# Altium project Simon_game.PrjPcb
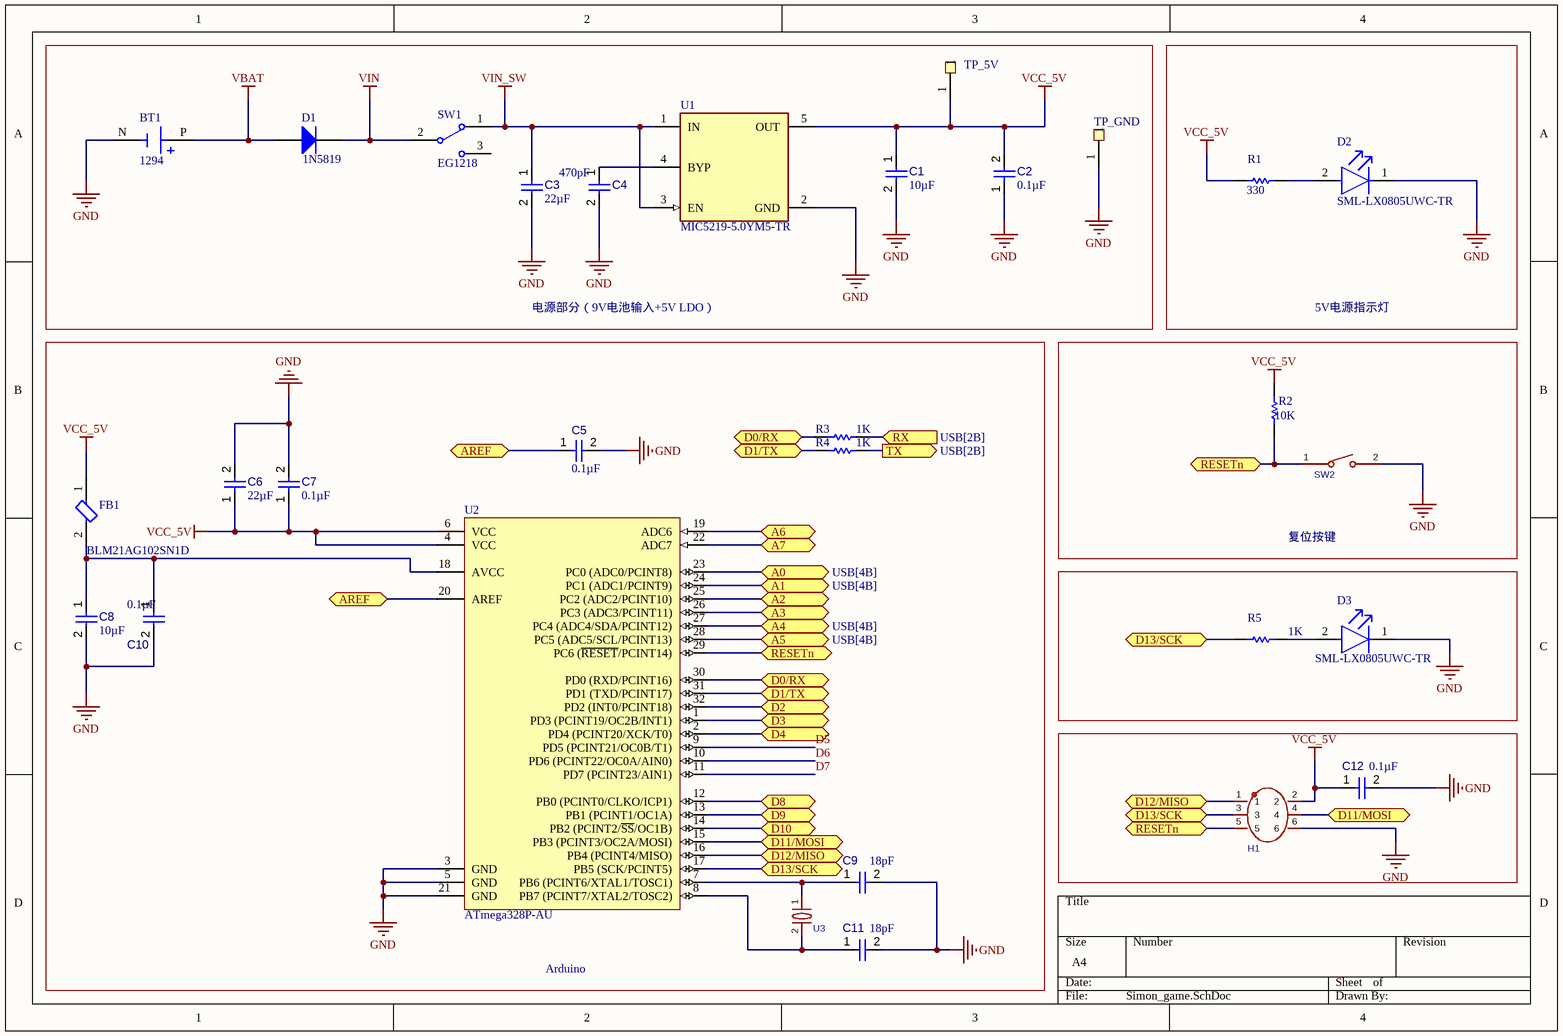
[diagram p0: Simon_game.SchDoc]
3 sheets, 87 parts. Net scope: global (net labels, ports and power ports of the same name join across sheets).
Board file: Simon_game.PcbDoc
Sheets:
  Simon_game.SchDoc
  USB.SchDoc
  buttons_audio_amplifier.SchDoc

## Sheet Simon_game.SchDoc
size A4; SheetNumber: 1; SheetTotal: 3

### Parts
BT1  1294  [BAT_1294]
C1  value 10µF  [CAPC2013X135X45NL10T25]  (hidden comment: Capacitor 10 uF +/- 10% 16 V 0805)
C2  value 0.1µF  [CAPC2013X135X45NL10T25]  (hidden comment: Capacitor 10 uF +/- 10% 16 V 0805)
C3  value 22µF  [CAPC2013X135X45NL10T25]  (hidden comment: Capacitor 10 uF +/- 10% 16 V 0805)
C4  value 470pF  [CAPC2013X135X45NL10T25]  (hidden comment: Capacitor 10 uF +/- 10% 16 V 0805)
C5  value 0.1µF  [CAPC2013X135X45NL10T25]  (hidden comment: Capacitor 10 uF +/- 10% 16 V 0805)
C6  value 22µF  [CAPC2013X135X45NL10T25]  (hidden comment: Capacitor 10 uF +/- 10% 16 V 0805)
C7  value 0.1µF  [CAPC2013X135X45NL10T25]  (hidden comment: Capacitor 10 uF +/- 10% 16 V 0805)
C8  value 10µF  [CAPC2013X135X45NL10T25]  (hidden comment: Capacitor 10 uF +/- 10% 16 V 0805)
C9  value 18pF  [CAPC2013X135X45NL10T25]  (hidden comment: Capacitor 10 uF +/- 10% 16 V 0805)
C10  value 0.1µF  [CAPC2013X135X45NL10T25]  (hidden comment: Capacitor 10 uF +/- 10% 16 V 0805)
C11  value 18pF  [CAPC2013X135X45NL10T25]  (hidden comment: Capacitor 10 uF +/- 10% 16 V 0805)
C12  value 0.1µF  [CAPC2013X135X45NL10T25]  (hidden comment: Capacitor 10 uF +/- 10% 16 V 0805)
D1  1N5819  [ONSC-AXIAL_LEAD-2-59-10_P]
D2  SML-LX0805UWC-TR  [FP-SML-LX0805UWC-TR-MFG]
D3  SML-LX0805UWC-TR  [FP-SML-LX0805UWC-TR-MFG]
FB1  BLM21AG102SN1D  [FP-BLM21-0_2-t0_85-e0_5-MFG]
H1  PM2.54-2*3  [HDR-TH_6P-P2.54-V-F-R2-C3-S2.54]  (value not drawn)
R1  value 330  [RESC2013X50X35ML15T15]  (hidden comment: Resistor 0R +/- 1% 0805 125 mW)
R2  value 10K  [RESC2013X50X35ML15T15]  (hidden comment: Resistor 0R +/- 1% 0805 125 mW)
R3  value 1K  [RESC2013X50X35ML15T15]  (hidden comment: Resistor 0R +/- 1% 0805 125 mW)
R4  value 1K  [RESC2013X50X35ML15T15]  (hidden comment: Resistor 0R +/- 1% 0805 125 mW)
R5  value 1K  [RESC2013X50X35ML15T15]  (hidden comment: Resistor 0R +/- 1% 0805 125 mW)
SW1  EG1218  [ESWI-EG1218_V]
SW2  TS-1088-AR02016  [SW-SMD_L3.9-W3.0-P4.45]  (value not drawn)
TP_5V  TP_5V  [PCBComponent_1]  (value not drawn)
TP_GND  Component_1  [PCBComponent_1]  (value not drawn)
U1  MIC5219-5.0YM5-TR  [FP-SOT23-5LD-PL-1-MFG]
U2  ATmega328P-AU  [32A_M]
U3  ABLS-12.000MHZ-B4H-T  [CRYSTAL-SMD_L11.4-W4.7-LS12.7]  (value not drawn)

### Blocks framed on the sheet
电源部分（9V电池输入+5V LDO）: BT1 C1-C4 D1 SW1 TP_5V TP_GND U1
5V电源指示灯: D2 R1
Arduino: C5-C11 FB1 R3 R4 U2 U3
复位按键: R2 SW2

### Ports
A0 (bidir, see USB[4B]), A1 (bidir, see USB[4B]), A2 (bidir, see buttons_audio_amplifier[3A], USB[4B]), A3 (bidir, see buttons_audio_amplifier[3A], USB[4B]), A4 (bidir, see USB[4B]), A5 (bidir, see USB[4B]), A6 (bidir, see buttons_audio_amplifier[3B], USB[4B]), A7 (bidir, see buttons_audio_amplifier[3B], USB[4B]), AREF (bidir, see Simon_game[1C], USB[4B]), AREF (bidir, see Simon_game[2B], USB[4B]), D0/RX (bidir, see Simon_game[2B], USB[4C]), D0/RX (bidir, see Simon_game[2C], USB[4C]), D1/TX (bidir, see Simon_game[2B], USB[4C]), D1/TX (bidir, see Simon_game[2C], USB[4C]), D2 (bidir, see USB[4C]), D3 (bidir, see USB[4C]), D4 (bidir, see USB[4C]), D8 (bidir, see buttons_audio_amplifier[4C], USB[4C]), D9 (bidir, see buttons_audio_amplifier[1C], USB[4C]), D10 (bidir, see USB[4C]), D11/MOSI (bidir, see Simon_game[2D], USB[4C]), D11/MOSI (bidir, see Simon_game[4D], USB[4C]), D12/MISO (bidir, see Simon_game[2D], USB[4C]), D12/MISO (bidir, see Simon_game[3D], USB[4C]), D13/SCK (bidir, see Simon_game[2D], Simon_game[3C], USB[4B]), D13/SCK (bidir, see Simon_game[2D], Simon_game[3D], USB[4B]), D13/SCK (bidir, see Simon_game[3C], Simon_game[3D], USB[4B]), RESETn (bidir, see Simon_game[2C], Simon_game[3D], USB[2B], USB[4B], USB[4C]), RESETn (bidir, see Simon_game[2C], Simon_game[4B], USB[2B], USB[4B], USB[4C]), RESETn (bidir, see Simon_game[3D], Simon_game[4B], USB[2B], USB[4B], USB[4C]), RX (in, see USB[2B]), TX (out, see USB[2B])

### Nets
GND: BT1.N(NEG) C1.2 C2.1 C3.2 C4.2 C5.2 C6.2 C7.2 C8.2 C9.2 C10.2 C11.2 C12.2 D2.1(C) D3.1(C) H1.6 SW2.2 TP_GND.1 U1.2(GND) U2.3(GND) U2.5(GND) U2.21(GND)
VBAT: BT1.P(POS) D1.1(A)
VCC_5V: C1.1 C2.2 C6.1 C7.1 C12.1 FB1.1 H1.2 R1.1 R2.2 TP_5V.1 U1.5(OUT) U2.4(VCC) U2.6(VCC)
VIN: D1.2(K) SW1.2(COM)
VIN_SW: C3.1 SW1.1 U1.1(IN) U1.3(EN)
D5: U2.9(PD5_(PCINT21/OC0B/T1))
D6: U2.10(PD6_(PCINT22/OC0A/AIN0))
D7: U2.11(PD7_(PCINT23/AIN1))
NetC4_1: C4.1 U1.4(BYP)
NetC5_1: C5.1 U2.20(AREF) ; port AREF
NetC8_1: C8.1 C10.1 FB1.2 U2.18(AVCC)
NetC9_1: C9.1 U2.7(PB6_(PCINT6/XTAL1/TOSC1)) U3.1
NetC11_1: C11.1 U2.8(PB7_(PCINT7/XTAL2/TOSC2)) U3.2(GND)
NetC17_2: H1.5 R2.1 SW2.1 U2.29(PC6_(~{RESET}/PCINT14)) ; port RESETn
NetD2_2: D2.2(A) R1.2
NetD3_2: D3.2(A) R5.2
NetH1_1: H1.1 U2.16(PB4_(PCINT4/MISO)) ; port D12/MISO
NetH1_3: H1.3 R5.1 U2.17(PB5_(SCK/PCINT5)) ; port D13/SCK
NetH1_4: H1.4 U2.15(PB3_(PCINT3/OC2A/MOSI)) ; port D11/MOSI
NetJ1_1: R4.1 U2.31(PD1_(TXD/PCINT17)) ; port D1/TX
NetJ1_2: R3.1 U2.30(PD0_(RXD/PCINT16)) ; port D0/RX
NetJ1_5: U2.32(PD2_(INT0/PCINT18)) ; port D2
NetJ1_6: U2.1(PD3_(PCINT19/OC2B/INT1)) ; port D3
NetJ1_7: U2.2(PD4_(PCINT20/XCK/T0)) ; port D4
NetJ1_11: U2.12(PB0_(PCINT0/CLKO/ICP1)) ; port D8
NetJ1_12: U2.13(PB1_(PCINT1/OC1A)) ; port D9
NetJ1_13: U2.14(PB2_(PCINT2/~{SS}/OC1B)) ; port D10
NetJ2_5: U2.22(ADC7) ; port A7
NetJ2_6: U2.19(ADC6) ; port A6
NetJ2_7: U2.28(PC5_(ADC5/SCL/PCINT13)) ; port A5
NetJ2_8: U2.27(PC4_(ADC4/SDA/PCINT12)) ; port A4
NetJ2_9: U2.26(PC3_(ADC3/PCINT11)) ; port A3
NetJ2_10: U2.25(PC2_(ADC2/PCINT10)) ; port A2
NetJ2_11: U2.24(PC1_(ADC1/PCINT9)) ; port A1
NetJ2_12: U2.23(PC0_(ADC0/PCINT8)) ; port A0
NetR3_2: R3.2 ; port RX
NetR4_2: R4.2 ; port TX

Not connected (* = marked no-connect by the designer): SW1 3

### Library data of the parts
BT1 = 1294: 9 Volt Battery Holder- PC Terminals; MF: Keystone Electronics; SnapEDA_Link: https://www.snapeda.com/parts/1294/Keystone/view-part/?ref=snap; Package: NON STANDARD-6 Keystone; Value: *; MP: 1294; Check_prices: https://www.snapeda.com/parts/1294/Keystone/view-part/?ref=eda
C1-C12 = CMP-001-00015-6: Chip Capacitor, 10 uF, +/- 10%, 16 V, 0805 (2012 Metric); Voltage Rating: 16V; Capacitor Type: Ceramic; RoHS Compliant: True; Max Operating Temperature: 85°C; Min Operating Temperature: -55°C; Mounting Technology: SM; Tolerance: 10%; Case/Package: 0805; Pins: 2
D1 = CMP-004-00009-2: Low Drop Power Schottky Rectifier, 40 V, 1 A, 2-Pin DO-41, RoHS; Manufacturer: ON Semiconductor; Max Surge Current: 25A; Forward Current: 1A; Package Version: Rev. U, 02/2005; Peak Reverse Current: 1mA; Max Operating Temperature: 125°C; Case/Package: DO; Package URL: http://www.onsemi.cn/pub_link/Collateral/59-10.PDF; Packaging: Bulk; Manufacturer URL: http://www.onsemi.com/; Min Operating Temperature: -65°C; Package Description: 2-Pin, Axial Lead, Diameter 2.35 mm; Mounting Technology: TH; Datasheet URL: http://www.onsemi.cn/pub_link/Collateral/1N5817-D.PDF; Datasheet Version: Rev. 10, 07/2006; Package Reference: AXIAL_LEAD-2-59-10; Pins: 2; RoHS Compliant: True
D2 D3 = CMP-00229-00139794-1: SML-LX0805UWC-TR White LED, 0805 Diffused, Rectangle Lens SMD package; NexarPartId: 139794; Approvals: CSA, UL; Lens Color: Clear, Yellow; Luminous Intensity: 150mcd; Power Rating: 120mW; Forward Current: 20mA; Forward Voltage: 3.5V; Number of LEDs: 1; Viewing Angle: 120°; RoHS: Compliant; Case/Package: 0805; Illumination Color: White; Min Operating Temperature: -40°C; Mount: Surface Mount; Max Operating Temperature: 85°C
FB1 = CMP-0686-00665-3: Chip Ferrite Bead, 0805, 1000Ω @ 100MHz, 0.27Ω, 25%, 600mA; Material: Steel; Number of Lines: 1; Current Rating: 500mA; Max DC Current: 200mA; Impedance: 1kR; DC Resistance (DCR): 280mR; Shielding: Unshielded; Length: 2mm; Max Current Rating: 600mA; Max Operating Temperature: 125°C; Lead Free: Lead Free; Test Frequency: 100MHz; Number of Pins: 2; Height: 0.85mm; Package Quantity: 1; Termination: SMD/SMT; Depth: 1.25mm; Radiation Hardening: No; Case Code (Metric): 2012; Tolerance: 25%; Core Material: Ferrite; Min Operating Temperature: -55°C; Case Code (Imperial): 0805; Weight: 0.000194oz; DC Current: 200mA; Case/Package: 0805; REACH SVHC: No SVHC; Frequency: 100MHz; Military Standard: Not; Number of Circuits: 1; Width: 1.25mm; Packaging: Tape and Reel
R1-R5 = CMP-009-00001-5: Chip Resistor, 0 Ohm, +/- 1%, 125 mW, -55 to 155 degC, 0805 (2012 Metric); Voltage Rating: 150V; Power: 125mW; Mounting Technology: SM; Max Operating Temperature: 155°C; Case/Package: 0805; RoHS Compliant: True; Pins: 2; Min Operating Temperature: -55°C; Tolerance: 1%
SW1 = CMP-1696-00002-1: Slide Switch, 500 V, -20 to 70 degC, 3-Pin THD, RoHS; Case\Package: SOT-23-5; Output Current: 150 mA; Nominal Output Voltage: 3.3 V; Max Power Dissipation: 250 mW; Min Input Voltage: 4.3 V; Outputs: 1; Max Input Voltage: 8 V; Dropout Voltage: 300 mV; PackageDescription: 3-Pin Through Hole Device, Body 11.6 x 4 mm, Pitch 2.5 mm; ComponentLink1URL: http://www.e-switch.ch/en/; RoHSCompliant: true; Length: 3 mm; ComponentLink1Description: Manufacturer URL; Power Rating: 250 mW; Mount: Surface Mount; Max Operating Temperature: 85 degC; REACH SVHC: No SVHC; Radiation Hardening: No; Height: 1.3 mm; Pins: 5; Max Ouput Current: 150 mA; Output Voltage: 3.3 V; Width: 1.8 mm; Package Quantity: 3000; ComponentLink2URL: https://www.e-switch.com/system/asset/product_line/data_sheet/119/EG.pdf; Min Operating Temperature: -40 degC; ComponentLink2Description: Datasheet; DatasheetVersion: Oct-15; PackageReference: EG1218; Packaging: Tape and Reel
TP_5V = Component_1
U1 = CMP-06324-000019-1: IC REG LINEAR 5V 500MA SOT23-5; Manufacturer: Microchip Technology; Number Of Outputs: 1; Accuracy Percentage: 1%; Min Supply Voltage: 2.5V; Dropout Voltage: 350mV; Nominal Supply Current: 80-12000uA; Standoff Height: 0mm; Max Junction Temp: +125°C; Output Type: Fixed; Max Supply Voltage: 12V; ComponentLink2Description: Datasheet; Manufacturer Part Number: MIC5219-5.0YM5-TR; Category: IC; Height: 1.45mm; Temperature: -40°C to +125°C; Device Class L1: Integrated Circuits (ICs); Device Class L3: Voltage Regulators - Linear; Octopart: https://octopart.com/mic5219-5.0ym5-tr-microchip-66802269; Output Current: 500mA; Temperature Range Low: -40°C; Lead Free: Yes; Package: SOT23-5LD-PL-1; Automotive: No; Ambient Temperature Range High: +125°C; ComponentLink2URL: http://ww1.microchip.com/downloads/en/DeviceDoc/MIC5219-500mA-Peak-Output-LDO-Regulator-DS20006021A.pdf; Output Voltage: 5V; Temperature Range High: +125°C; Digikey Description: IC REG LINEAR 5V 500MA SOT23-5; Ambient Temperature Range Low: -40°C; RoHS: TRUE; Mouser Description: IC REG LINEAR 5V 500MA SOT23-5; Device Class L2: Power Management ICs
U2 = CMP-0095-00269-2: 8-bit AVR Microcontroller, 32KB Flash, 1KB EEPROM, 2KB SRAM, 32-pin TQFP, Industrial Grade (-40°C to 85°C); PackageDescription: 32-Lead, 7x7x1.0 mm Body, 0.8mm Lead Pitch, Thin Profile Plastic Quad Flat Package (TQFP); DatasheetVersion: revD, May-2011; RevisionNote: DatasheetVersion & PackageVersion updated. URLs added.; ComponentLink1URL: http://www.atmel.com/; ComponentLink2Description: ATmega48A/48PA/88A/88PA/168A/168PA/328/328P Datasheet; Code_JEDEC: MS-026-ABA; ComponentLink1Description: Manufacturer URL; PackageReference: 32A; ComponentLink3Description: ATmega48A/48PA/88A/88PA/168A/168PA/328/328P Summary; ComponentLink2URL: http://www.atmel.com/dyn/resources/prod_documents/doc8271.pdf; PackageVersion: revC, Oct-2010; ComponentLink3URL: http://www.atmel.com/dyn/resources/prod_documents/8271S.pdf
H1 = PM2.54-2*3: Symbol: PM2.54-2*3
SW2 = TS-1088-AR02016: Symbol: TS-1088-AR02016
U3 = ABLS-12.000MHZ-B4H-T: Symbol: ABLS-12.000MHZ-B4H-T

## Sheet USB.SchDoc
size A4; SheetNumber: 2; SheetTotal: 3
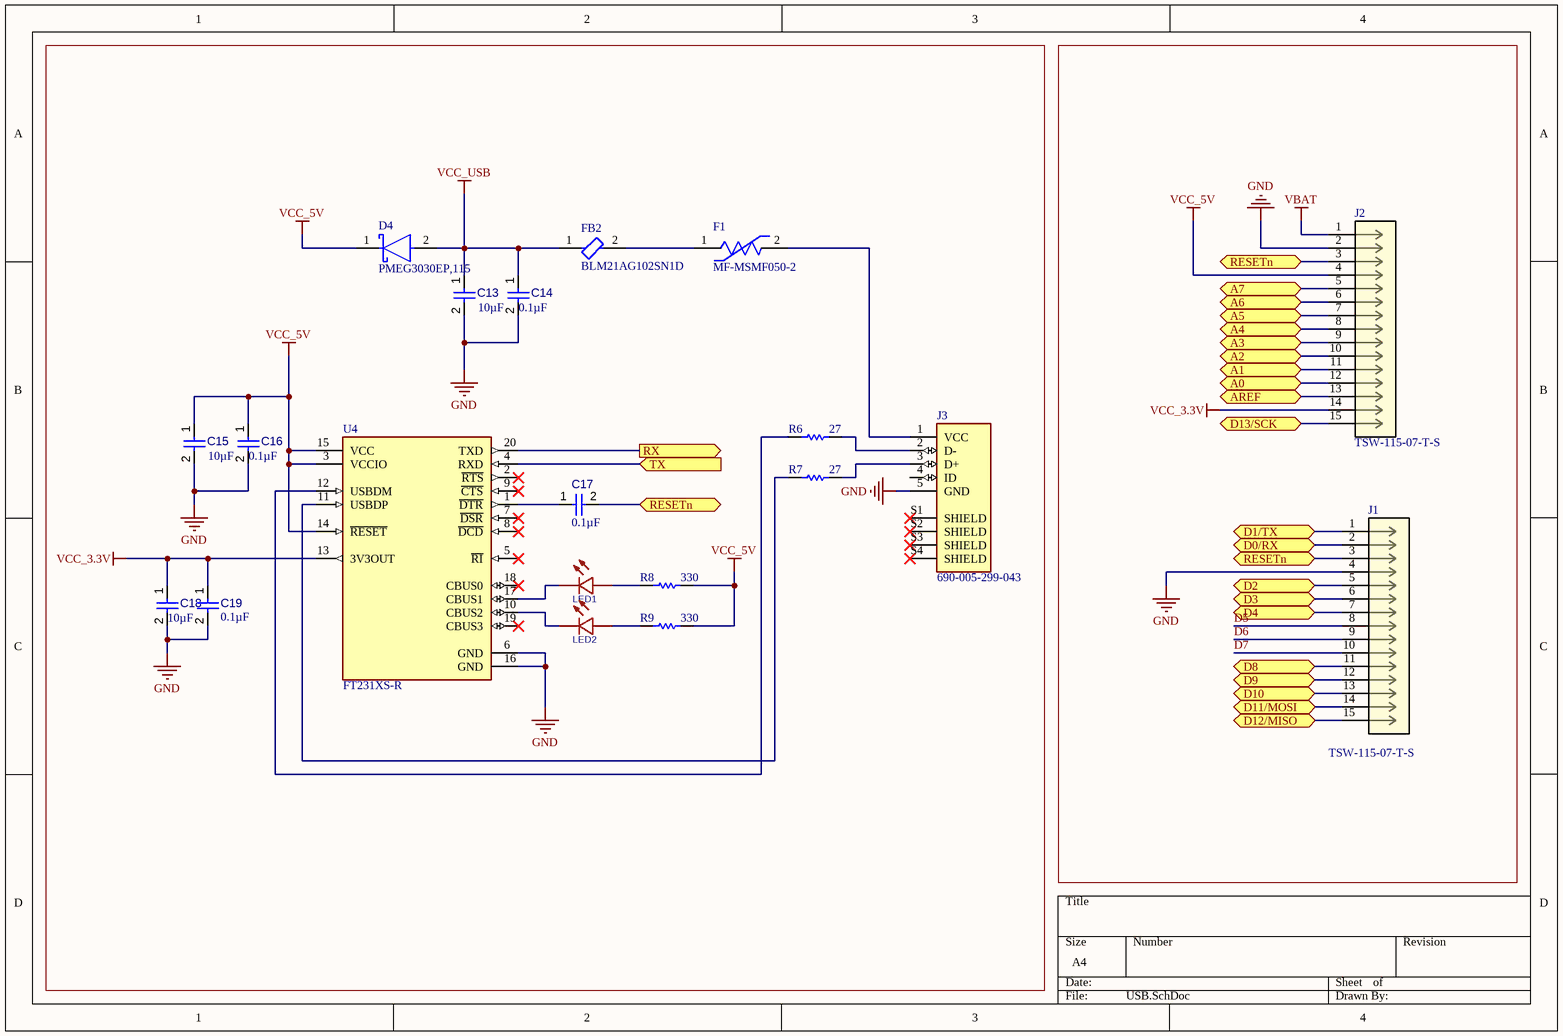
[diagram p1: USB.SchDoc]

### Parts
C13  value 10µF  [CAPC2013X135X45NL10T25]  (hidden comment: Capacitor 10 uF +/- 10% 16 V 0805)
C14  value 0.1µF  [CAPC2013X135X45NL10T25]  (hidden comment: Capacitor 10 uF +/- 10% 16 V 0805)
C15  value 10µF  [CAPC2013X135X45NL10T25]  (hidden comment: Capacitor 10 uF +/- 10% 16 V 0805)
C16  value 0.1µF  [CAPC2013X135X45NL10T25]  (hidden comment: Capacitor 10 uF +/- 10% 16 V 0805)
C17  value 0.1µF  [CAPC2013X135X45NL10T25]  (hidden comment: Capacitor 10 uF +/- 10% 16 V 0805)
C18  value 10µF  [CAPC2013X135X45NL10T25]  (hidden comment: Capacitor 10 uF +/- 10% 16 V 0805)
C19  value 0.1µF  [CAPC2013X135X45NL10T25]  (hidden comment: Capacitor 10 uF +/- 10% 16 V 0805)
D4  PMEG3030EP,115  [FP-SOD128-MFG]
F1  MF-MSMF050-2  [FP-MF-MSMF050-2-MFG]
FB2  BLM21AG102SN1D  [FP-BLM21-0_2-t0_85-e0_5-MFG]
J1  TSW-115-07-T-S  [CON15_1X15_TU_TSW]
J2  TSW-115-07-T-S  [CON15_1X15_TU_TSW]
J3  690-005-299-043  [690-005-299-043_EDA]
LED1  FC-DA1608HRK-620D  [LED0603-RD_RED]  (value not drawn)
LED2  FC-DA1608HRK-620D  [LED0603-RD_RED]  (value not drawn)
R6  value 27  [RESC2013X50X35ML15T15]  (hidden comment: Resistor 0R +/- 1% 0805 125 mW)
R7  value 27  [RESC2013X50X35ML15T15]  (hidden comment: Resistor 0R +/- 1% 0805 125 mW)
R8  value 330  [RESC2013X50X35ML15T15]  (hidden comment: Resistor 0R +/- 1% 0805 125 mW)
R9  value 330  [RESC2013X50X35ML15T15]  (hidden comment: Resistor 0R +/- 1% 0805 125 mW)
U4  FT231XS-R  [FP-SSOP-20-MFG]

### Ports
A0 (bidir, see Simon_game[2C]), A1 (bidir, see Simon_game[2C]), A2 (bidir, see buttons_audio_amplifier[3A], Simon_game[2C]), A3 (bidir, see buttons_audio_amplifier[3A], Simon_game[2C]), A4 (bidir, see Simon_game[2C]), A5 (bidir, see Simon_game[2C]), A6 (bidir, see buttons_audio_amplifier[3B], Simon_game[2C]), A7 (bidir, see buttons_audio_amplifier[3B], Simon_game[2C]), AREF (bidir, see Simon_game[1C], Simon_game[2B]), D0/RX (bidir, see Simon_game[2B], Simon_game[2C]), D1/TX (bidir, see Simon_game[2B], Simon_game[2C]), D2 (bidir, see Simon_game[2C]), D3 (bidir, see Simon_game[2C]), D4 (bidir, see Simon_game[2C]), D8 (bidir, see buttons_audio_amplifier[4C], Simon_game[2D]), D9 (bidir, see buttons_audio_amplifier[1C], Simon_game[2D]), D10 (bidir, see Simon_game[2D]), D11/MOSI (bidir, see Simon_game[2D], Simon_game[4D]), D12/MISO (bidir, see Simon_game[2D], Simon_game[3D]), D13/SCK (bidir, see Simon_game[2D], Simon_game[3C], Simon_game[3D]), RESETn (bidir, see Simon_game[2C], Simon_game[3D], Simon_game[4B], USB[2B], USB[4B]), RESETn (bidir, see Simon_game[2C], Simon_game[3D], Simon_game[4B], USB[2B], USB[4C]), RESETn (bidir, see Simon_game[2C], Simon_game[3D], Simon_game[4B], USB[4B], USB[4C]), RX (out, see Simon_game[3B]), TX (in, see Simon_game[3B])

### Nets
GND: C13.2 C14.2 C15.2 C16.2 C18.2 C19.2 J1.4 J2.2 J3.5(GND) U4.6(GND) U4.16(GND)
VBAT: J2.1
VCC_3.3V: C18.1 C19.1 J2.14 U4.13(3V3OUT)
VCC_5V: C15.1 C16.1 D4.1(C) J2.4 R8.2 R9.2 U4.3(VCCIO) U4.14(~{RESET}) U4.15(VCC)
VCC_USB: C13.1 C14.1 D4.2(A) FB2.1
D5: J1.8
D6: J1.9
D7: J1.10
NetC5_1: J2.13 ; port AREF
NetC17_1: C17.1 U4.1(~{DTR})
NetC17_2: C17.2 J1.3 J2.3 ; port RESETn
NetF1_1: F1.1 FB2.2
NetF1_2: F1.2 J3.1(VCC)
NetH1_1: J1.15 ; port D12/MISO
NetH1_3: J2.15 ; port D13/SCK
NetH1_4: J1.14 ; port D11/MOSI
NetJ1_1: J1.1 ; port D1/TX
NetJ1_2: J1.2 ; port D0/RX
NetJ1_5: J1.5 ; port D2
NetJ1_6: J1.6 ; port D3
NetJ1_7: J1.7 ; port D4
NetJ1_11: J1.11 ; port D8
NetJ1_12: J1.12 ; port D9
NetJ1_13: J1.13 ; port D10
NetJ2_5: J2.5 ; port A7
NetJ2_6: J2.6 ; port A6
NetJ2_7: J2.7 ; port A5
NetJ2_8: J2.8 ; port A4
NetJ2_9: J2.9 ; port A3
NetJ2_10: J2.10 ; port A2
NetJ2_11: J2.11 ; port A1
NetJ2_12: J2.12 ; port A0
NetJ3_2: J3.2(D-) R6.2
NetJ3_3: J3.3(D+) R7.2
NetLED1_1: LED1.1(K) U4.17(CBUS1)
NetLED1_2: LED1.2(A) R8.1
NetLED2_1: LED2.1(K) U4.10(CBUS2)
NetLED2_2: LED2.2(A) R9.1
NetR3_2: U4.20(TXD) ; port RX
NetR4_2: U4.4(RXD) ; port TX
NetR6_1: R6.1 U4.12(USBDM)
NetR7_1: R7.1 U4.11(USBDP)

Not connected (* = marked no-connect by the designer): J3 4(ID) S1(SHIELD)* S2(SHIELD)* S3(SHIELD)* S4(SHIELD)*; U4 2(~{RTS})* 5(~{RI})* 7(~{DSR})* 8(~{DCD})* 9(~{CTS})* 18(CBUS0)* 19(CBUS3)*

### Library data of the parts
C13-C19 = CMP-001-00015-6: as C1 on sheet Simon_game; RoHS Compliant: True; Max Operating Temperature: 85°C; Min Operating Temperature: -55°C; Mounting Technology: SM; Tolerance: 10%; Case/Package: 0805; Pins: 2
D4 = CMP-14398-000052-1: DIODE SCHOTTKY 30V 3A SOD128; RoHS Compliant: Yes
F1 = CMP-2100-03653-2: PTC RESET FUSE 15V 500MA 1812; Manufacturer: Bourns; Value: 0.15-1Ω; Trip Current: 1A; Automotive Grade: Grade 3; Trip Time: 0.15s; Current Rating: 100A; Hold Current: 0.5A; Height: 0.85mm; Package: 1812; Voltage Rating: 15V; Temperature Range High: +85°C; Device Class L2: PTC Resettable Fuses; Lead Free: Yes; ComponentLink2URL: http://www.bourns.com/docs/Product-Datasheets/mfmsmf.pdf; Ambient Temperature Range High: +85°C; Mouser Description: PTC Resettable Fuse 0.5A(hold) 1A(trip) 15V 100A 0.8W 0.15s 0.15Ohm SMD Solder Pad 1812 T/R; Digikey Description: PTC RESET FUSE 15V 500MA 1812; Manufacturer Part Number: MF-MSMF050-2; Resistance: 0.15-1Ω; Category: Fuse; ComponentLink2Description: Datasheet; Automotive: Yes; Temperature Range Low: -40°C; RoHS: TRUE; Device Class L1: Circuit Protection; Temperature: -40°C to +85°C; Octopart: https://octopart.com/mf-msmf050-2-bourns-28047; Ambient Temperature Range Low: -40°C; Device Class L3: unset
FB2 = CMP-0686-00665-3: as FB1 on sheet Simon_game; Length: 2mm; Max Current Rating: 600mA; Max Operating Temperature: 125°C; Lead Free: Lead Free; Test Frequency: 100MHz; Number of Pins: 2; Height: 0.85mm; Package Quantity: 1; Termination: SMD/SMT; Depth: 1.25mm; Radiation Hardening: No; Case Code (Metric): 2012; Tolerance: 25%; Core Material: Ferrite; Min Operating Temperature: -55°C; Case Code (Imperial): 0805; Weight: 0.000194oz; DC Current: 200mA; Case/Package: 0805; REACH SVHC: No SVHC; Frequency: 100MHz; Military Standard: Not; Number of Circuits: 1; Width: 1.25mm; Packaging: Tape and Reel
J1 J2 = TSW-115-07-T-S: No Description Available; Manufacturer_Name: Samtec Inc; Copyright: Copyright (C) 2026 Ultra Librarian. All rights reserved.; Manufacturer_Part_Number: TSW-115-07-T-S; RefDes: RefDes; Type: Type
J3 = 690-005-299-043: USB - mini B USB 2.0 Receptacle Connector 5 Position Surface Mount, Right Angle; MF: EDAC Inc.; SnapEDA_Link: https://www.snapeda.com/parts/690-005-299-043/EDAC/view-part/?ref=snap; Package: None; Value: *; MP: 690-005-299-043; Check_prices: https://www.snapeda.com/parts/690-005-299-043/EDAC/view-part/?ref=eda
R6-R9 = CMP-009-00001-5: as R1 on sheet Simon_game; Mounting Technology: SM; Max Operating Temperature: 155°C; Case/Package: 0805; RoHS Compliant: True; Pins: 2; Min Operating Temperature: -55°C; Tolerance: 1%
U4 = CMP-0248-00024-3: IC USB SERIAL FULL UART 20SSOP; Operating Supply Voltage: 5V; Operating Supply Current: 8mA; Number of Channels: 1; Min Supply Voltage: 2.97V; Max Supply Voltage: 5.5V; Data Rate: 12Mbps; Height: 0.059inch; Packaging: Tape and Reel; Mount: Surface Mount; Package Quantity: 2000; Radiation Hardening: No; Case/Package: SSOP; Min Operating Temperature: -40°C; Width: 0.157inch; Number of Pins: 20; Weight: 0.016oz; Interface: UART; Max Operating Temperature: 85°C; Length: 8.74mm
LED1 LED2 = FC-DA1608HRK-620D: Symbol: FC-DA1608HRK-620D

## Sheet buttons_audio_amplifier.SchDoc
size A4; SheetNumber: 3; SheetTotal: 3
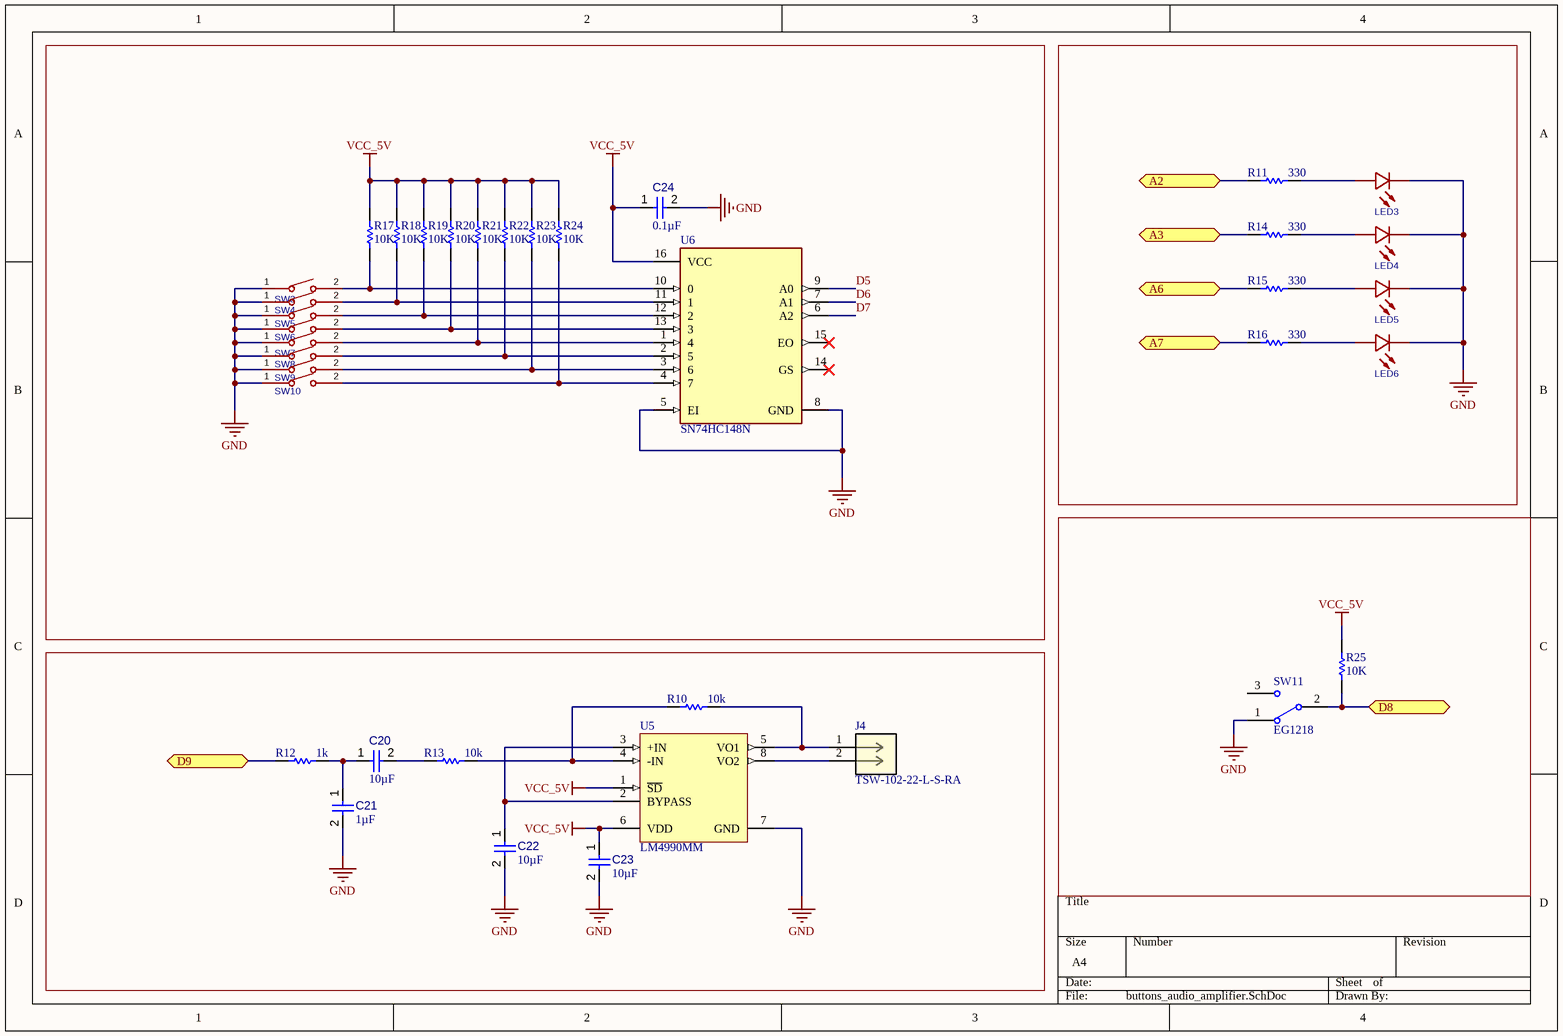
[diagram p2: buttons_audio_amplifier.SchDoc]

### Parts
C20  value 10µF  [CAPC2013X135X45NL10T25]  (hidden comment: Capacitor 10 uF +/- 10% 16 V 0805)
C21  value 1µF  [CAPC2013X135X45NL10T25]  (hidden comment: Capacitor 10 uF +/- 10% 16 V 0805)
C22  value 10µF  [CAPC2013X135X45NL10T25]  (hidden comment: Capacitor 10 uF +/- 10% 16 V 0805)
C23  value 10µF  [CAPC2013X135X45NL10T25]  (hidden comment: Capacitor 10 uF +/- 10% 16 V 0805)
C24  value 0.1µF  [CAPC2013X135X45NL10T25]  (hidden comment: Capacitor 10 uF +/- 10% 16 V 0805)
J4  TSW-102-22-L-S-RA  [CON2_1X2_TR_TSW_SAI]
LED3  FC-DA1608HRK-620D  [LED0603-RD_RED]  (value not drawn)
LED4  FC-DA1608HRK-620D  [LED0603-RD_RED]  (value not drawn)
LED5  FC-DA1608HRK-620D  [LED0603-RD_RED]  (value not drawn)
LED6  FC-DA1608HRK-620D  [LED0603-RD_RED]  (value not drawn)
R10  value 10k  [RESC2013X50X35ML15T15]  (hidden comment: Resistor 0R +/- 1% 0805 125 mW)
R11  value 330  [RESC2013X50X35ML15T15]  (hidden comment: Resistor 0R +/- 1% 0805 125 mW)
R12  value 1k  [RESC2013X50X35ML15T15]  (hidden comment: Resistor 0R +/- 1% 0805 125 mW)
R13  value 10k  [RESC2013X50X35ML15T15]  (hidden comment: Resistor 0R +/- 1% 0805 125 mW)
R14  value 330  [RESC2013X50X35ML15T15]  (hidden comment: Resistor 0R +/- 1% 0805 125 mW)
R15  value 330  [RESC2013X50X35ML15T15]  (hidden comment: Resistor 0R +/- 1% 0805 125 mW)
R16  value 330  [RESC2013X50X35ML15T15]  (hidden comment: Resistor 0R +/- 1% 0805 125 mW)
R17  value 10K  [RESC2013X50X35ML15T15]  (hidden comment: Resistor 0R +/- 1% 0805 125 mW)
R18  value 10K  [RESC2013X50X35ML15T15]  (hidden comment: Resistor 0R +/- 1% 0805 125 mW)
R19  value 10K  [RESC2013X50X35ML15T15]  (hidden comment: Resistor 0R +/- 1% 0805 125 mW)
R20  value 10K  [RESC2013X50X35ML15T15]  (hidden comment: Resistor 0R +/- 1% 0805 125 mW)
R21  value 10K  [RESC2013X50X35ML15T15]  (hidden comment: Resistor 0R +/- 1% 0805 125 mW)
R22  value 10K  [RESC2013X50X35ML15T15]  (hidden comment: Resistor 0R +/- 1% 0805 125 mW)
R23  value 10K  [RESC2013X50X35ML15T15]  (hidden comment: Resistor 0R +/- 1% 0805 125 mW)
R24  value 10K  [RESC2013X50X35ML15T15]  (hidden comment: Resistor 0R +/- 1% 0805 125 mW)
R25  value 10K  [RESC2013X50X35ML15T15]  (hidden comment: Resistor 0R +/- 1% 0805 125 mW)
SW3  TS-1088-AR02016  [SW-SMD_L3.9-W3.0-P4.45]  (value not drawn)
SW4  TS-1088-AR02016  [SW-SMD_L3.9-W3.0-P4.45]  (value not drawn)
SW5  TS-1088-AR02016  [SW-SMD_L3.9-W3.0-P4.45]  (value not drawn)
SW6  TS-1088-AR02016  [SW-SMD_L3.9-W3.0-P4.45]  (value not drawn)
SW7  TS-1088-AR02016  [SW-SMD_L3.9-W3.0-P4.45]  (value not drawn)
SW8  TS-1088-AR02016  [SW-SMD_L3.9-W3.0-P4.45]  (value not drawn)
SW9  TS-1088-AR02016  [SW-SMD_L3.9-W3.0-P4.45]  (value not drawn)
SW10  TS-1088-AR02016  [SW-SMD_L3.9-W3.0-P4.45]  (value not drawn)
SW11  EG1218  [ESWI-EG1218_V]
U5  LM4990MM  [DGK0008A_N]
U6  SN74HC148N  [FP-N0016A-MFG]

### Ports
A2 (bidir, see Simon_game[2C], USB[4B]), A3 (bidir, see Simon_game[2C], USB[4B]), A6 (bidir, see Simon_game[2C], USB[4B]), A7 (bidir, see Simon_game[2C], USB[4B]), D8 (bidir, see Simon_game[2D], USB[4C]), D9 (bidir, see Simon_game[2D], USB[4C])

### Nets
GND: C21.2 C22.2 C23.2 C24.2 LED3.1(K) LED4.1(K) LED5.1(K) LED6.1(K) SW3.1 SW4.1 SW5.1 SW6.1 SW7.1 SW8.1 SW9.1 SW10.1 SW11.1 U5.7(GND) U6.5(EI) U6.8(GND)
VCC_5V: C23.1 C24.1 R17.1 R18.1 R19.1 R20.1 R21.1 R22.1 R23.1 R24.1 R25.1 U5.1(~{SD}) U5.6(VDD) U6.16(VCC)
D5: U6.9(A0)
D6: U6.7(A1)
D7: U6.6(A2)
NetC20_1: C20.1 C21.1 R12.2
NetC20_2: C20.2 R13.1
NetC22_1: C22.1 U5.2(BYPASS) U5.3(+IN)
NetJ1_11: R25.2 SW11.2(COM) ; port D8
NetJ1_12: R12.1 ; port D9
NetJ2_5: R16.1 ; port A7
NetJ2_6: R15.1 ; port A6
NetJ2_9: R14.1 ; port A3
NetJ2_10: R11.1 ; port A2
NetJ4_1: J4.1 R10.2 U5.5(VO1)
NetJ4_2: J4.2 U5.8(VO2)
NetLED3_2: LED3.2(A) R11.2
NetLED4_2: LED4.2(A) R14.2
NetLED5_2: LED5.2(A) R15.2
NetLED6_2: LED6.2(A) R16.2
NetR10_1: R10.1 R13.2 U5.4(-IN)
NetR17_2: R17.2 SW3.2 U6.10(0)
NetR18_2: R18.2 SW4.2 U6.11(1)
NetR19_2: R19.2 SW5.2 U6.12(2)
NetR20_2: R20.2 SW6.2 U6.13(3)
NetR21_2: R21.2 SW7.2 U6.1(4)
NetR22_2: R22.2 SW8.2 U6.2(5)
NetR23_2: R23.2 SW9.2 U6.3(6)
NetR24_2: R24.2 SW10.2 U6.4(7)

Not connected (* = marked no-connect by the designer): SW11 3; U6 14(GS)* 15(EO)*

### Library data of the parts
C20-C24 = CMP-001-00015-6: as C1 on sheet Simon_game; RoHS Compliant: True; Max Operating Temperature: 85°C; Min Operating Temperature: -55°C; Mounting Technology: SM; Tolerance: 10%; Case/Package: 0805; Pins: 2
J4 = TSW-102-22-L-S-RA: No Description Available; Manufacturer_Name: Samtec Inc; Copyright: Copyright (C) 2026 Ultra Librarian. All rights reserved.; Manufacturer_Part_Number: TSW-102-22-L-S-RA; RefDes: RefDes; Type: Type
R10-R25 = CMP-009-00001-5: as R1 on sheet Simon_game; Mounting Technology: SM; Max Operating Temperature: 155°C; Case/Package: 0805; RoHS Compliant: True; Pins: 2; Min Operating Temperature: -55°C; Tolerance: 1%
SW11 = CMP-1696-00002-1: as SW1 on sheet Simon_game; PackageDescription: 3-Pin Through Hole Device, Body 11.6 x 4 mm, Pitch 2.5 mm; ComponentLink1URL: http://www.e-switch.ch/en/; RoHSCompliant: true; Length: 3 mm; ComponentLink1Description: Manufacturer URL; Power Rating: 250 mW; Mount: Surface Mount; Max Operating Temperature: 85 degC; REACH SVHC: No SVHC; Radiation Hardening: No; Height: 1.3 mm; Pins: 5; Max Ouput Current: 150 mA; Output Voltage: 3.3 V; Width: 1.8 mm; Package Quantity: 3000; ComponentLink2URL: https://www.e-switch.com/system/asset/product_line/data_sheet/119/EG.pdf; Min Operating Temperature: -40 degC; ComponentLink2Description: Datasheet; DatasheetVersion: Oct-15; PackageReference: EG1218; Packaging: Tape and Reel
U5 = CMP-0057-00586-3: 2W Audio Power Amplifier with Selectable Shutdown Logic Level, 8-pin Mini SOIC; Manufacturer: Texas Instruments; PowerWise: N; CompType: Audio IC; PackageTopMarking: ZXTT*GA5; ComponentLink1Description: Datasheet URL; ComponentLink1URL: http://www.ti.com/general/docs/lit/getliterature.tsp?genericPartNumber=LM4990&fileType=pdf; PackageReference: DGK0008A; Code_JEDEC: MO-187-AA; RoHS: N; PinCount: 8; PackageDescription: MINI SOIC, .118 x .118 x .034in, 8 Lead, .0256in Pitch
U6 = CMP-1633-00702-3: IC PRIORITY ENCOD 1 X 8:3 16DIP; Logic Function: Multiplexer; Turn-On Delay Time: 245ns; Supply Type: Single; Min Supply Voltage: 2V; Number of Input Lines: 8; Independent Circuits: 1; Operating Supply Voltage: 5V; High Level Output Current: 5.2mA; Bandwidth: 28MHz; Max Supply Voltage: 6V; Number of Output Lines: 3; Nominal Supply Current: 100uA; Case/Package: PDIP; Height: 4.57mm; Contact Plating: Gold; Length: 19.3mm; Mount: Through Hole; REACH SVHC: No SVHC; Propagation Delay: 245ns; Min Operating Temperature: -40°C; Number of Circuits: 1; Number of Pins: 16; Lead Free: Lead Free; Packaging: Rail/Tube; Radiation Hardening: No; Weight: 0.03357oz; Max Operating Temperature: 85°C; Number of Bits: 8; Width: 6.35mm; Number of Channels: 1; RoHS Compliant: Yes; Package Quantity: 25; Number of Outputs: 3; Number of Inputs: 8; Low Level Output Current: 5.2mA
LED3-LED6 = FC-DA1608HRK-620D: Symbol: FC-DA1608HRK-620D
SW3-SW10 = TS-1088-AR02016: Symbol: TS-1088-AR02016

## Nets that join several sheets
GND: Simon_game (22 pins), USB (11 pins), buttons_audio_amplifier (20 pins)
VBAT: Simon_game (BT1.P D1.1), USB (J2.1)
VCC_5V: Simon_game (13 pins), USB (9 pins), buttons_audio_amplifier (14 pins)
D5: Simon_game (U2.9), USB (J1.8), buttons_audio_amplifier (U6.9)
D6: Simon_game (U2.10), USB (J1.9), buttons_audio_amplifier (U6.7)
D7: Simon_game (U2.11), USB (J1.10), buttons_audio_amplifier (U6.6)
NetC5_1: Simon_game (C5.1 U2.20), USB (J2.13)
NetC17_2: Simon_game (H1.5 R2.1 SW2.1 U2.29), USB (C17.2 J1.3 J2.3)
NetH1_1: Simon_game (H1.1 U2.16), USB (J1.15)
NetH1_3: Simon_game (H1.3 R5.1 U2.17), USB (J2.15)
NetH1_4: Simon_game (H1.4 U2.15), USB (J1.14)
NetJ1_1: Simon_game (R4.1 U2.31), USB (J1.1)
NetJ1_2: Simon_game (R3.1 U2.30), USB (J1.2)
NetJ1_5: Simon_game (U2.32), USB (J1.5)
NetJ1_6: Simon_game (U2.1), USB (J1.6)
NetJ1_7: Simon_game (U2.2), USB (J1.7)
NetJ1_11: Simon_game (U2.12), USB (J1.11), buttons_audio_amplifier (R25.2 SW11.2)
NetJ1_12: Simon_game (U2.13), USB (J1.12), buttons_audio_amplifier (R12.1)
NetJ1_13: Simon_game (U2.14), USB (J1.13)
NetJ2_5: Simon_game (U2.22), USB (J2.5), buttons_audio_amplifier (R16.1)
NetJ2_6: Simon_game (U2.19), USB (J2.6), buttons_audio_amplifier (R15.1)
NetJ2_7: Simon_game (U2.28), USB (J2.7)
NetJ2_8: Simon_game (U2.27), USB (J2.8)
NetJ2_9: Simon_game (U2.26), USB (J2.9), buttons_audio_amplifier (R14.1)
NetJ2_10: Simon_game (U2.25), USB (J2.10), buttons_audio_amplifier (R11.1)
NetJ2_11: Simon_game (U2.24), USB (J2.11)
NetJ2_12: Simon_game (U2.23), USB (J2.12)
NetR3_2: Simon_game (R3.2), USB (U4.20)
NetR4_2: Simon_game (R4.2), USB (U4.4)